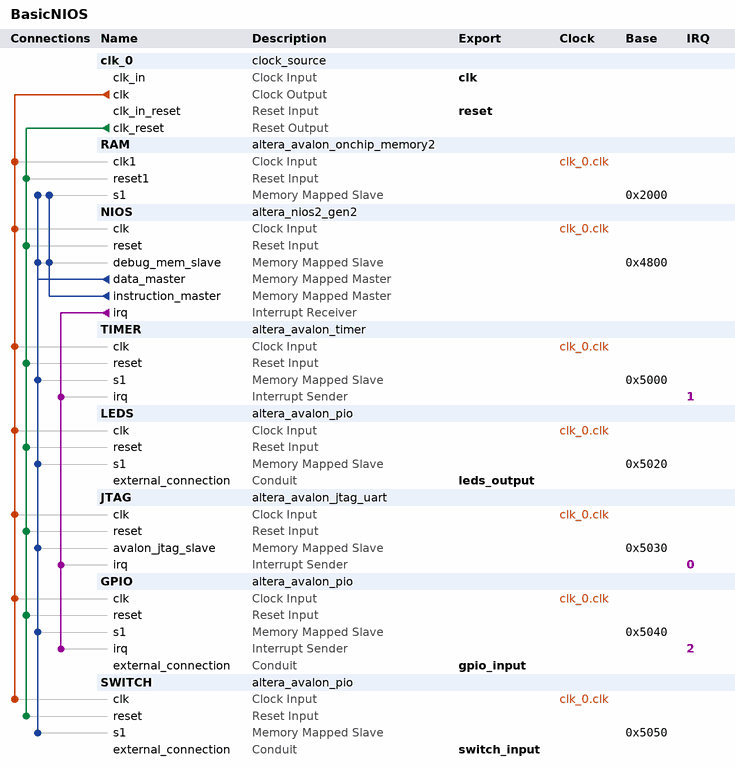
[diagram p0: system contents]
# Platform Designer (Qsys) system BasicNIOS, Cyclone V 5CSEMA5F31C6
# Parameters at their usual value, and those the tool derives, are not listed.
package require -exact qsys 18.1
create_system BasicNIOS
set_project_property DEVICE_FAMILY {Cyclone V}
set_project_property DEVICE 5CSEMA5F31C6

add_instance clk_0 clock_source 18.1
set_instance_parameter_value clk_0 clockFrequency 50000000

add_instance RAM altera_avalon_onchip_memory2 18.1
set_instance_parameter_value RAM dataWidth 32
set_instance_parameter_value RAM dualPort false
set_instance_parameter_value RAM initMemContent true
set_instance_parameter_value RAM initializationFileName onchip_mem.hex
set_instance_parameter_value RAM memorySize 8192

add_instance NIOS altera_nios2_gen2 18.1
set_instance_parameter_value NIOS dcache_size 2048
set_instance_parameter_value NIOS exceptionSlave RAM.s1
set_instance_parameter_value NIOS icache_size 4096
set_instance_parameter_value NIOS impl Tiny
set_instance_parameter_value NIOS resetSlave RAM.s1

add_instance TIMER altera_avalon_timer 18.1
set_instance_parameter_value TIMER fixedPeriod true
set_instance_parameter_value TIMER period 1
set_instance_parameter_value TIMER periodUnits MSEC

add_instance LEDS altera_avalon_pio 18.1
set_instance_parameter_value LEDS direction Output
set_instance_parameter_value LEDS width 32

add_instance JTAG altera_avalon_jtag_uart 18.1
set_instance_parameter_value JTAG simInteractiveOptions NO_INTERACTIVE_WINDOWS

add_instance GPIO altera_avalon_pio 18.1
set_instance_parameter_value GPIO bitClearingEdgeCapReg true
set_instance_parameter_value GPIO captureEdge true
set_instance_parameter_value GPIO direction Input
set_instance_parameter_value GPIO edgeType ANY
set_instance_parameter_value GPIO generateIRQ true
set_instance_parameter_value GPIO irqType EDGE
set_instance_parameter_value GPIO simDoTestBenchWiring true
set_instance_parameter_value GPIO width 4

add_instance SWITCH altera_avalon_pio 18.1
set_instance_parameter_value SWITCH direction Input
set_instance_parameter_value SWITCH simDoTestBenchWiring true
set_instance_parameter_value SWITCH width 10

# connections
add_connection clk_0.clk GPIO.clk clock
add_connection clk_0.clk JTAG.clk clock
add_connection clk_0.clk LEDS.clk clock
add_connection clk_0.clk NIOS.clk clock
add_connection clk_0.clk RAM.clk1 clock
add_connection clk_0.clk SWITCH.clk clock
add_connection clk_0.clk TIMER.clk clock
add_connection clk_0.clk_reset GPIO.reset reset
add_connection clk_0.clk_reset JTAG.reset reset
add_connection clk_0.clk_reset LEDS.reset reset
add_connection clk_0.clk_reset NIOS.reset reset
add_connection clk_0.clk_reset RAM.reset1 reset
add_connection clk_0.clk_reset SWITCH.reset reset
add_connection clk_0.clk_reset TIMER.reset reset
add_connection NIOS.data_master GPIO.s1 avalon
set_connection_parameter_value NIOS.data_master/GPIO.s1 baseAddress 0x5040
add_connection NIOS.data_master JTAG.avalon_jtag_slave avalon
set_connection_parameter_value NIOS.data_master/JTAG.avalon_jtag_slave baseAddress 0x5030
add_connection NIOS.data_master LEDS.s1 avalon
set_connection_parameter_value NIOS.data_master/LEDS.s1 baseAddress 0x5020
add_connection NIOS.data_master NIOS.debug_mem_slave avalon
set_connection_parameter_value NIOS.data_master/NIOS.debug_mem_slave baseAddress 0x4800
add_connection NIOS.data_master RAM.s1 avalon
set_connection_parameter_value NIOS.data_master/RAM.s1 baseAddress 0x2000
add_connection NIOS.data_master SWITCH.s1 avalon
set_connection_parameter_value NIOS.data_master/SWITCH.s1 baseAddress 0x5050
add_connection NIOS.data_master TIMER.s1 avalon
set_connection_parameter_value NIOS.data_master/TIMER.s1 baseAddress 0x5000
add_connection NIOS.instruction_master NIOS.debug_mem_slave avalon
set_connection_parameter_value NIOS.instruction_master/NIOS.debug_mem_slave baseAddress 0x4800
add_connection NIOS.instruction_master RAM.s1 avalon
set_connection_parameter_value NIOS.instruction_master/RAM.s1 baseAddress 0x2000
add_connection NIOS.irq GPIO.irq interrupt
set_connection_parameter_value NIOS.irq/GPIO.irq irqNumber 2
add_connection NIOS.irq JTAG.irq interrupt
set_connection_parameter_value NIOS.irq/JTAG.irq irqNumber 0
add_connection NIOS.irq TIMER.irq interrupt
set_connection_parameter_value NIOS.irq/TIMER.irq irqNumber 1

# exported interfaces
add_interface clk clock sink
set_interface_property clk EXPORT_OF clk_0.clk_in
add_interface gpio_input conduit end
set_interface_property gpio_input EXPORT_OF GPIO.external_connection
add_interface leds_output conduit end
set_interface_property leds_output EXPORT_OF LEDS.external_connection
add_interface reset reset sink
set_interface_property reset EXPORT_OF clk_0.clk_in_reset
add_interface switch_input conduit end
set_interface_property switch_input EXPORT_OF SWITCH.external_connection

set_interconnect_requirement {$system} qsys_mm.clockCrossingAdapter HANDSHAKE
set_interconnect_requirement {$system} qsys_mm.enableEccProtection FALSE
set_interconnect_requirement {$system} qsys_mm.insertDefaultSlave FALSE
set_interconnect_requirement {$system} qsys_mm.maxAdditionalLatency 1

save_system BasicNIOS.qsys
